# EAGLE schematic BCD_7SD_Decoder_1.1 (EAGLE 7.6.0)
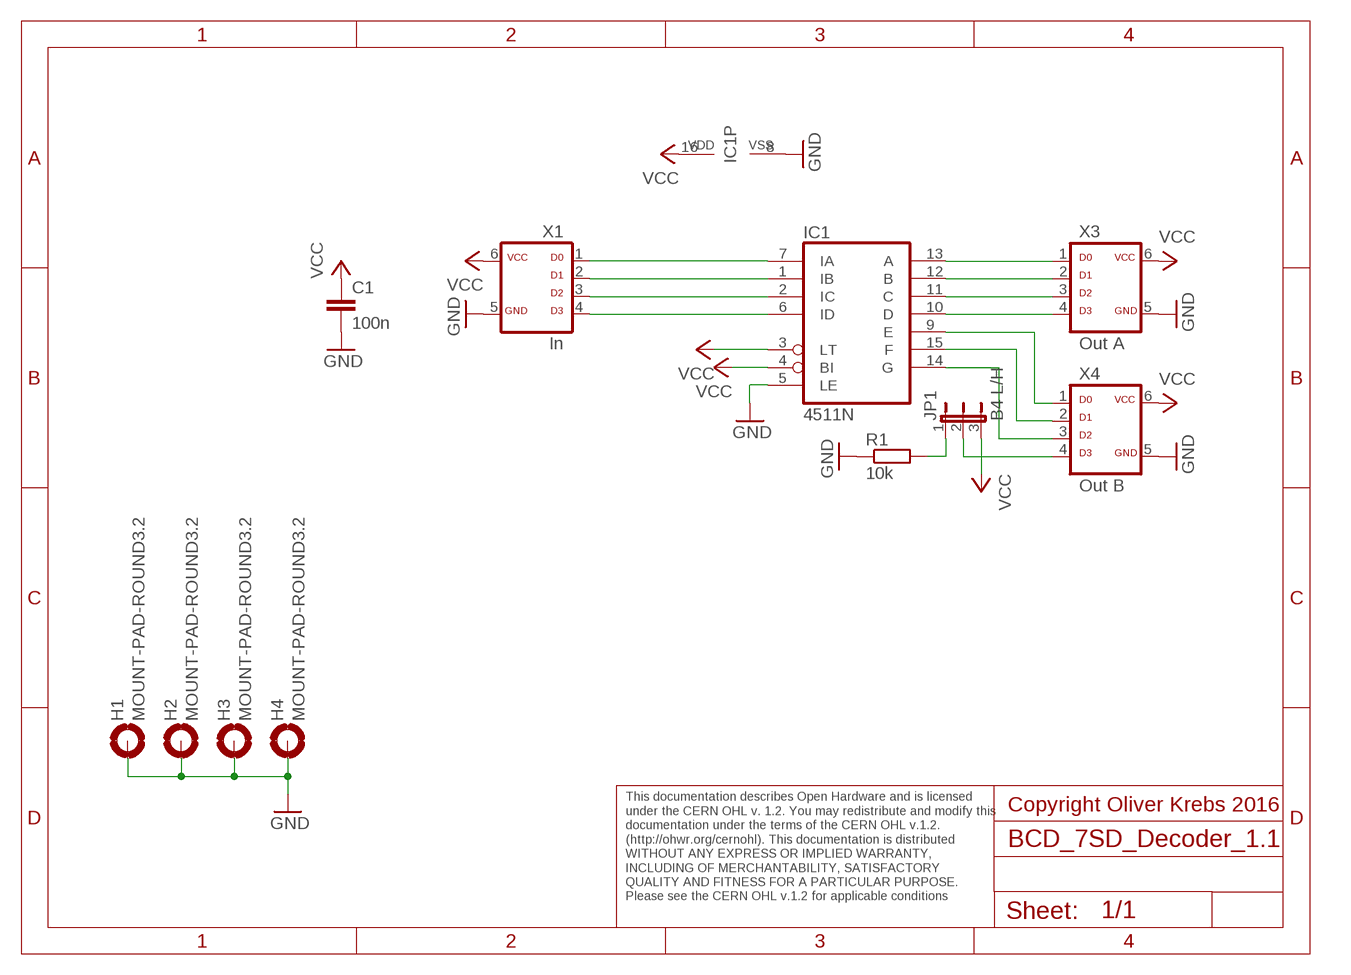
[diagram p0: schematic, sheet 1]

## Parts
C1  100n  C-EU050-025X075  [C050-025X075]
H1  MOUNT-PAD-ROUND3.2  [3,2-PAD]
H2  MOUNT-PAD-ROUND3.2  [3,2-PAD]
H3  MOUNT-PAD-ROUND3.2  [3,2-PAD]
H4  MOUNT-PAD-ROUND3.2  [3,2-PAD]
IC1  4511N  [DIL16]
JP1  B4 L/H  JP2E  [JP2]
R1  10k  R-EU_0207/10  [0207/10]
X1  In  ML6D  [ML-6]
X3  Out A  ML6D  [ML-6]
X4  Out B  ML6D  [ML-6]

## Nets
GND: C1.2 H1.B3,2(MOUNT) H2.B3,2(MOUNT) H3.B3,2(MOUNT) H4.B3,2(MOUNT) IC1.5(LE) IC1.8(VSS) R1.1 X1.5 X3.5 X4.5
N$1: IC1.7(IA) X1.1
N$2: IC1.1(IB) X1.2
N$3: IC1.2(IC) X1.3
N$4: IC1.6(ID) X1.4
N$5: IC1.13(A) X3.1
N$6: IC1.12(B) X3.2
N$7: IC1.11(C) X3.3
N$8: IC1.10(D) X3.4
N$9: IC1.9(E) X4.1
N$10: IC1.15(F) X4.2
N$11: IC1.14(G) X4.3
N$13: JP1.2 X4.4
N$14: JP1.1 R1.2
VCC: C1.1 IC1.3(LT) IC1.4(BI) IC1.16(VDD) JP1.3 X1.6 X3.6 X4.6

## Notes on the sheet
- Copyright Oliver Krebs 2016
- This documentation describes Open Hardware and is licensed 
  under the CERN OHL v. 1.2. You may redistribute and modify this 
  documentation under the terms of the CERN OHL v.1.2. 
  (http://ohwr.org/cernohl). This documentation is distributed
  WITHOUT ANY EXPRESS OR IMPLIED WARRANTY, 
  INCLUDING OF MERCHANTABILITY, SATISFACTORY 
  QUALITY AND FITNESS FOR A PARTICULAR PURPOSE. 
  Please see the CERN OHL v.1.2 for applicable conditions

## Library data of the parts
C1 = 01-my_rcl:C-EU: CAPACITOR, European symbol
H1-H4 = holes:MOUNT-PAD-ROUND: MOUNTING PAD, round
IC1 = 45xx:4511: BCD to 7-segment LATCH/DECODER/DRIVER
JP1 = jumper:JP2E: JUMPER
R1 = 01-my_rcl:R-EU_: RESISTOR, European symbol
X1 X3 X4 = 01-my-con:ML6D